# Altium schematic sheet Sheet1.SchDoc: The schematic of Tube Board of XDM-1
size A4; Author: ALU; DrawnBy: alu; Engineer: alu; Revision: 1; SheetNumber: 1; SheetTotal: 1; Time: NoTime
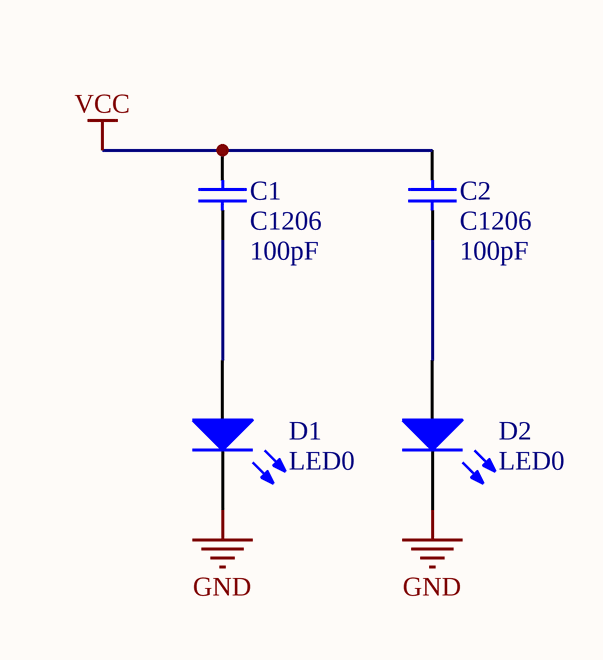
[diagram p0: Sheet1.SchDoc]

## Parts
C1  C1206  value 100pF  [1206]
C2  C1206  value 100pF  [1206]
D1  LED0  [0805]
D2  LED0  [LED-0]

## Nets
GND: D1.2(K) D2.2(K)
VCC: C1.2 C2.2
NetC1_1: C1.1 D1.1(A)
NetC2_1: C2.1 D2.1(A)

## Library data of the parts
C1 C2 = C1206: Ceramic Chip Capacitor - Standard; Published: 17-Jul-2002; LatestRevisionDate: 19-Mar-2004; LatestRevisionNote: Silkscreen size reduced.; DatasheetDocument: Mar-2001; PackageDocument: Mar-2001; PackageReference: 1206; Publisher: Altium Limited; Code_JEITA: 1206; Code_IPC: 3216 [1206]; ComponentLink1Description: Manufacturer Link; ComponentLink1URL: http://www.kemet.com/; ComponentLink2Description: Datasheet; ComponentLink2URL: http://www.kemet.com/kemet/web/homepage/kechome.nsf/vapubfilesname/F3102TA.pdf/$file/F3102TA.pdf
D1 D2 = LED0: Typical INFRARED GaAs LED; Published: 8-Jun-2000; LatestRevisionDate: 08-Jul-2005; LatestRevisionNote: Mech Layer 1 removed.; PackageReference: LED-0; Publisher: Altium Limited